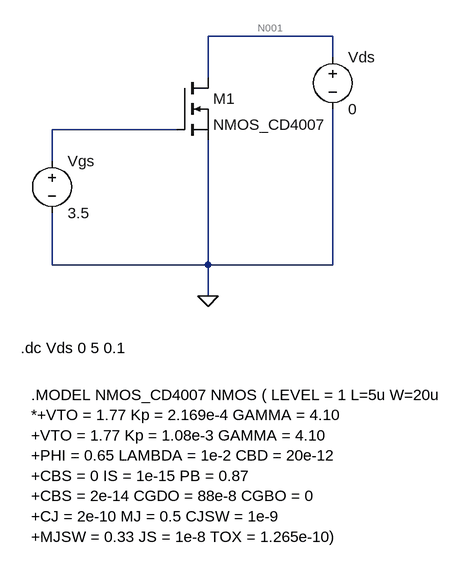
[diagram p0: schematic C1_MOS.asc]
C1_MOS.asc, the LTspice schematic file:
Version 4.1
SHEET 1 880 796
WIRE 352 32 160 32
WIRE 352 64 352 32
WIRE 160 96 160 32
WIRE 112 176 -80 176
WIRE -80 224 -80 176
WIRE -80 384 -80 304
WIRE 160 384 160 192
WIRE 160 384 -80 384
WIRE 352 384 352 144
WIRE 352 384 160 384
WIRE 160 432 160 384
FLAG 160 432 0
SYMBOL nmos 112 96 R0
SYMATTR InstName M1
SYMATTR Value NMOS_CD4007
SYMBOL voltage -80 208 R0
WINDOW 123 0 0 Left 0
WINDOW 39 0 0 Left 0
SYMATTR InstName Vgs
SYMATTR Value 3.5
SYMBOL voltage 352 48 R0
WINDOW 123 0 0 Left 0
WINDOW 39 0 0 Left 0
SYMATTR InstName Vds
SYMATTR Value 0
TEXT -112 584 Left 2 !.MODEL NMOS_CD4007 NMOS ( LEVEL = 1 L=5u W=20u\n*+VTO = 1.77 Kp = 2.169e-4 GAMMA = 4.10\n+VTO = 1.77 Kp = 1.08e-3 GAMMA = 4.10\n+PHI = 0.65 LAMBDA = 1e-2 CBD = 20e-12\n+CBS = 0 IS = 1e-15 PB = 0.87\n+CBS = 2e-14 CGDO = 88e-8 CGBO = 0\n+CJ = 2e-10 MJ = 0.5 CJSW = 1e-9\n+MJSW = 0.33 JS = 1e-8 TOX = 1.265e-10)
TEXT -128 512 Left 2 !.dc Vds 0 5 0.1

The netlist it stands for:
* C1_MOS.asc
M1 N001 N002 0 0 NMOS_CD4007
Vgs N002 0 3.5
Vds N001 0 0
.model NMOS NMOS
.model PMOS PMOS
.lib standard.mos
.MODEL NMOS_CD4007 NMOS ( LEVEL = 1 L=5u W=20u
*+VTO = 1.77 Kp = 2.169e-4 GAMMA = 4.10
+VTO = 1.77 Kp = 1.08e-3 GAMMA = 4.10
+PHI = 0.65 LAMBDA = 1e-2 CBD = 20e-12
+CBS = 0 IS = 1e-15 PB = 0.87
+CBS = 2e-14 CGDO = 88e-8 CGBO = 0
+CJ = 2e-10 MJ = 0.5 CJSW = 1e-9
+MJSW = 0.33 JS = 1e-8 TOX = 1.265e-10)
.dc Vds 0 5 0.1
.backanno
.end

* Results of the author's LTspice run, read from the files saved beside the schematic
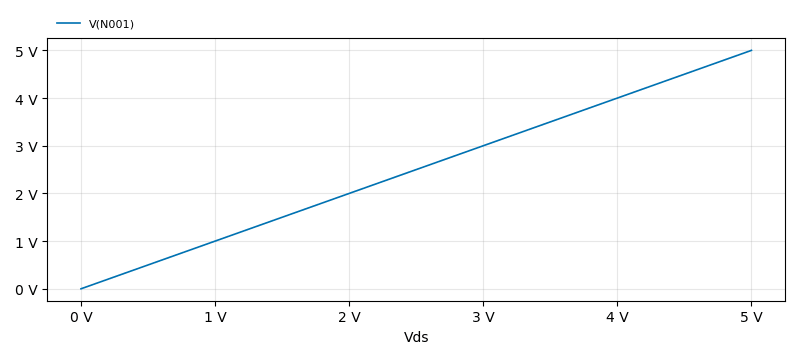
[diagram p1: DC transfer characteristic of C1_MOS.asc, plotted from the saved traces]
* DC transfer characteristic, 1 run:
*   V(N001): 0 V at Vds=0 V, 5 V at Vds=5 V, min 0 V, max 5 V